# Altium project DMRobot.PrjPcb
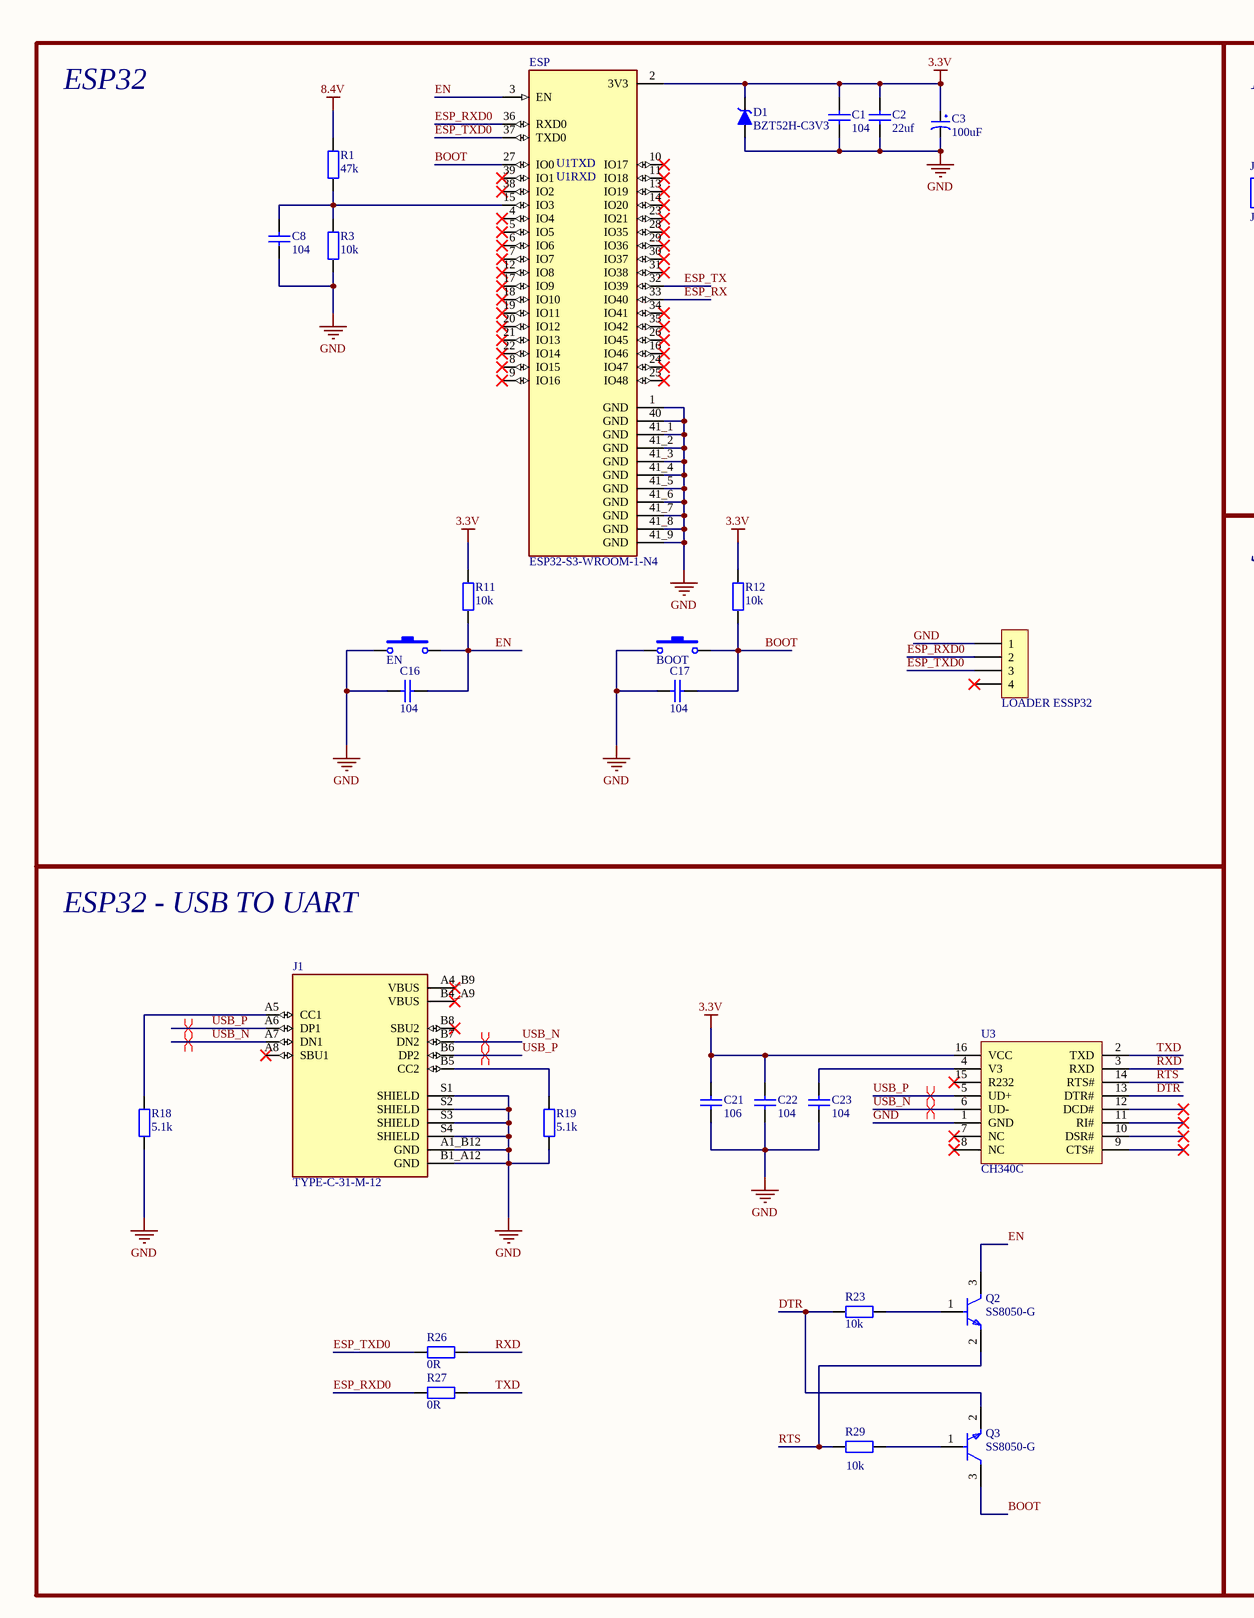
[diagram p0: DMRobotSchematic.SchDoc, left]
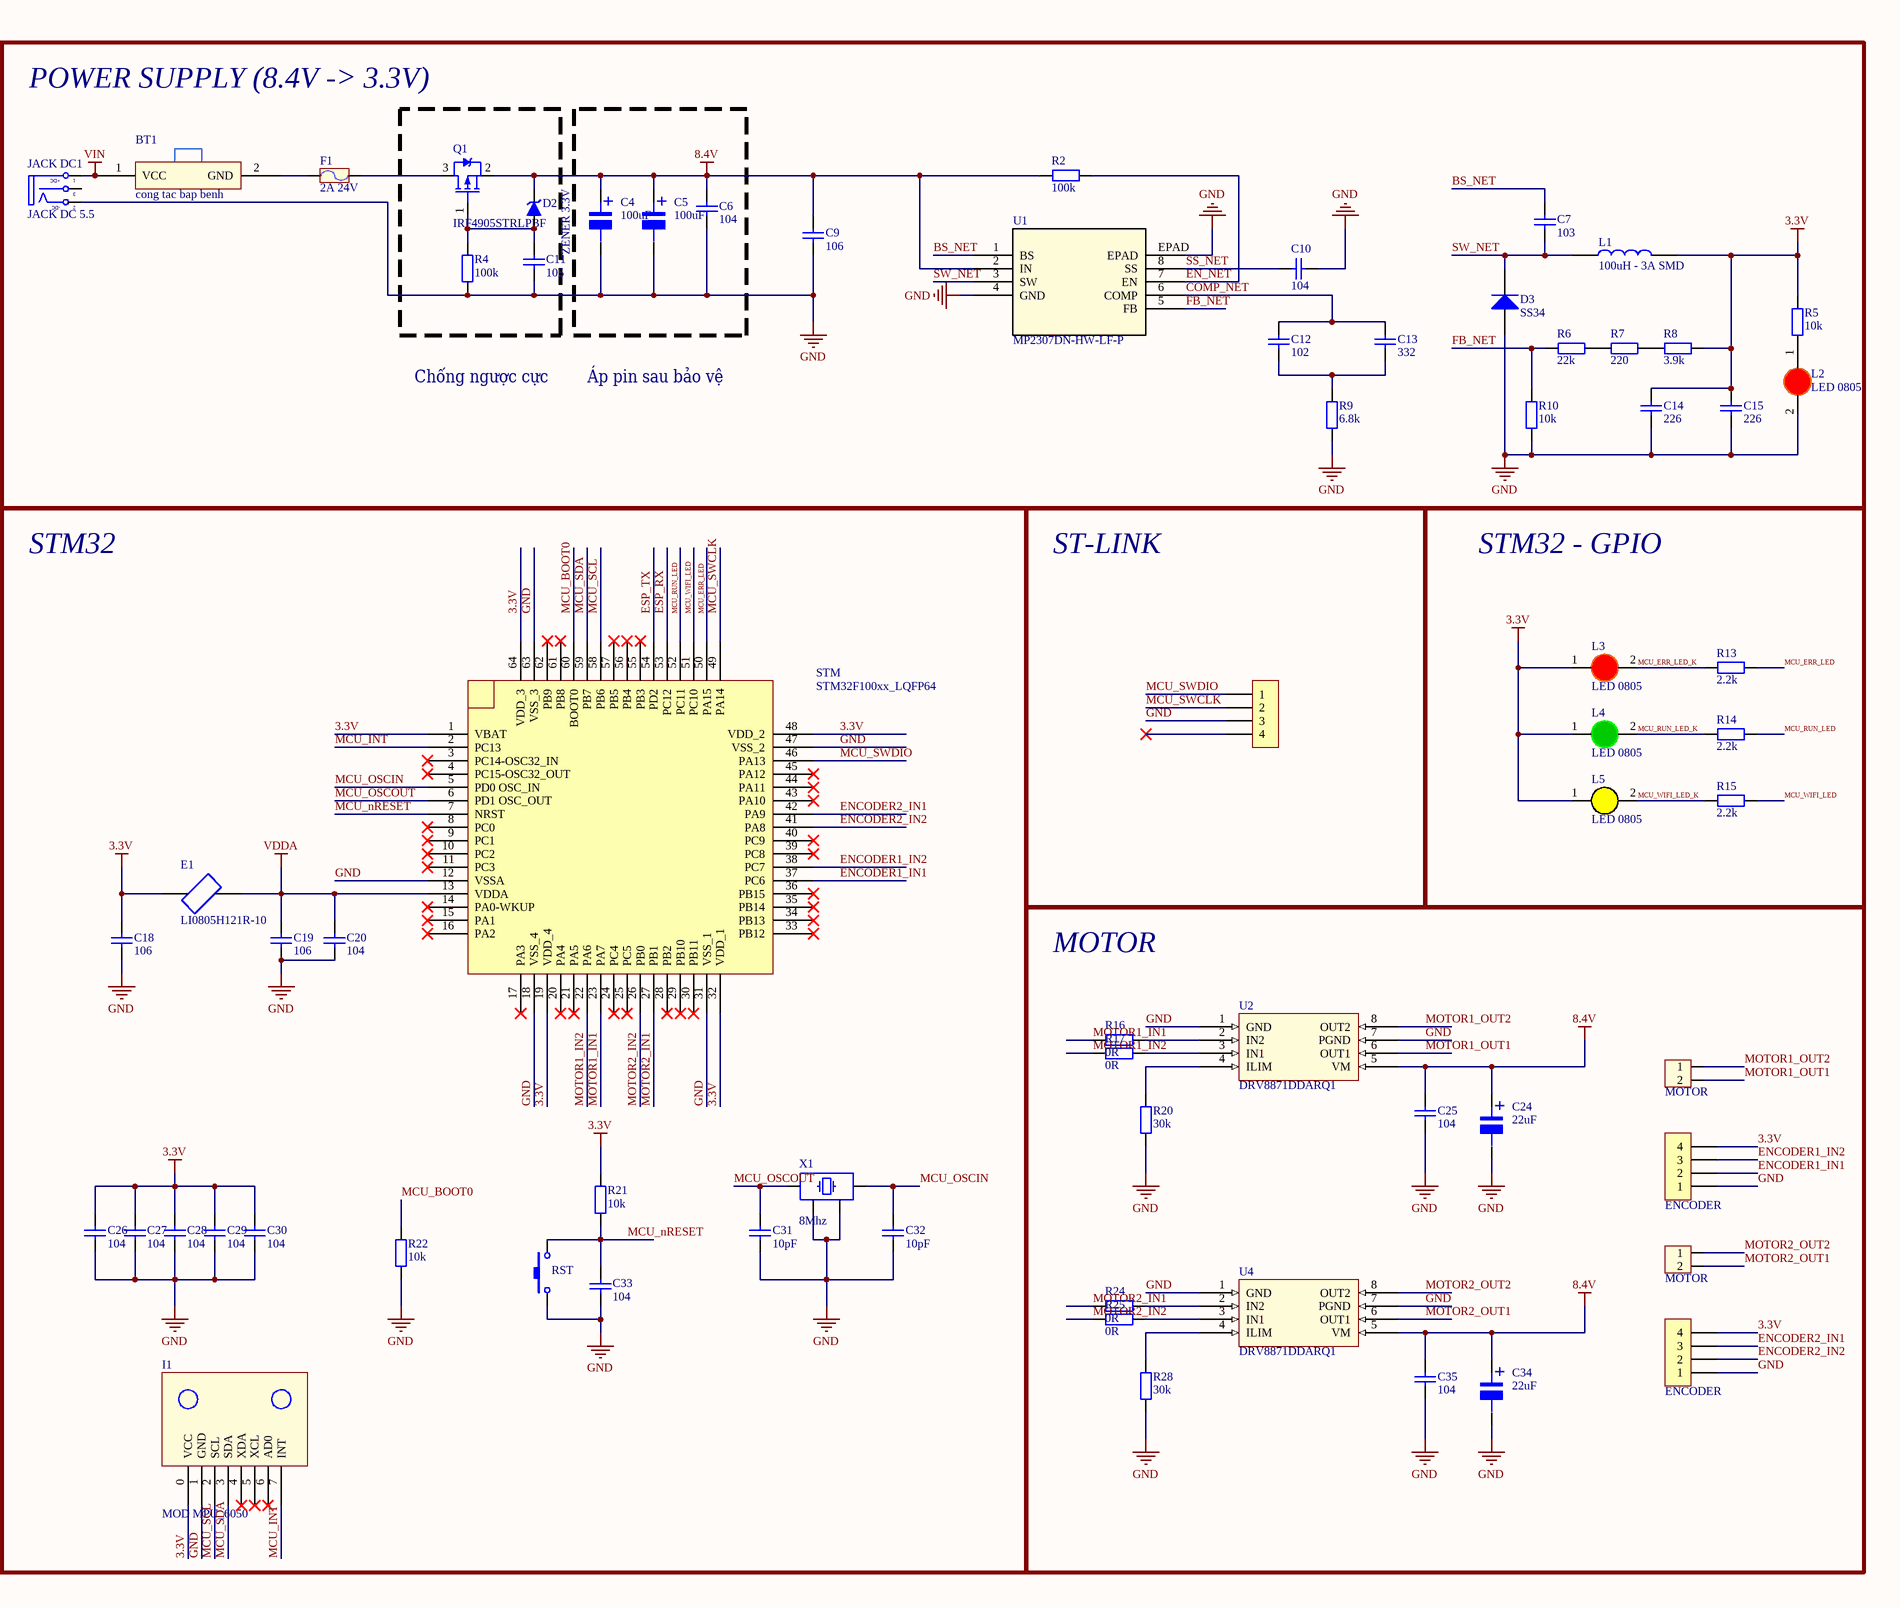
[diagram p1: DMRobotSchematic.SchDoc, right]
1 sheet, 97 parts. Net scope: global (net labels, ports and power ports of the same name join across sheets).
Board file: DMRobotPCB.PcbDoc

## Sheet DMRobotSchematic.SchDoc
size 622 x 355 mm; SheetNumber: 1; SheetTotal: 1

### Parts
BOOT  Nut Nhan 2 Chan SMD 3x6x2.5  [Nut Nhan 2 Chan SMD 3x6x2.5]  (value not drawn)
BT1  cong tac bap benh  [CONG TAC BAP BENH]
C1  104  [tu 0805]
C2  22uf  [tu 0805]
C3  100uF  [tu tantalum smd7343]
C4  100uF  [tu nhom 6.3 (d)]
C5  100uF  [tu nhom 6.3 (d)]
C6  104  [tu 0805]
C7  103  [tu 0805]
C8  104  [tu 0805]
C9  106  [tu 0805]
C10  104  [tu 0805]
C11  105  [tu 0805]
C12  102  [tu 0805]
C13  332  [tu 0805]
C14  226  [tu 1206]
C15  226  [tu 1206]
C16  104  [tu 0805]
C17  104  [tu 0805]
C18  106  [tu 0805]
C19  106  [tu 0805]
C20  104  [tu 0805]
C21  106  [tu 0805]
C22  104  [tu 0805]
C23  104  [tu 0805]
C24  22uF  [tu nhom 6.3 (D)]
C25  104  [tu 0805]
C26  104  [tu 0805]
C27  104  [tu 0805]
C28  104  [tu 0805]
C29  104  [tu 0805]
C30  104  [tu 0805]
C31  10pF  [tu 0805]
C32  10pF  [tu 0805]
C33  104  [tu 0805]
C34  22uF  [tu nhom 6.3 (D)]
C35  104  [tu 0805]
D1  BZT52H-C3V3  [SOD123]
D2  ZENER 3.3V  [SOD123]
D3  SS34  [DIODE SMA]
E1  LI0805H121R-10  [FB_LI0805H121R-10]
EN  Nut Nhan 2 Chan SMD 3x6x2.5  [Nut Nhan 2 Chan SMD 3x6x2.5]  (value not drawn)
ENC1  ENCODER  [XH2.54M-4]
ENC2  ENCODER  [XH2.54M-4]
ESP  ESP32-S3-WROOM-1-N4  [XCVR_ESP32-S3-WROOM-1-N4]
ESP_FLASH  LOADER ESSP32  [XH2.54M-4]
F1  2A 24V  [Cau chi tu phuc hoi 2A 24V SMD1812]
I1  MOD MPU_6050  [MOD MPU-6050]
J1  TYPE-C-31-M-12  [HRO_TYPE-C-31-M-12]
JACK_DC1  JACK DC 5.5  [JACK DC 5.5]
L1  100uH - 3A SMD  [Cuon Cam 12x12x10]
L2  LED 0805  [LED-0805-Red]
L3  LED 0805  [LED-0805-Red]
L4  LED 0805  [LED-0805-Green]
L5  LED 0805  [LED-0805-Yellow]
M1  MOTOR  [XH2.54M-2]
M2  MOTOR  [XH2.54M-2]
Q1  IRF4905STRLPBF  [TO-263 (D2PAK)]
Q2  SS8050-G  [FP-SS8050-G-MFG]
Q3  SS8050-G  [FP-SS8050-G-MFG]
R1  47k  [tro smd 0603]
R2  100k  [tro smd 0805]
R3  10k  [tro smd 0805]
R4  100k  [tro smd 0805]
R5  10k  [tro smd 0805]
R6  22k  [tro smd 0805]
R7  220  [tro smd 0805]
R8  3.9k  [Tro SMD 0805]
R9  6.8k  [tro smd 0805]
R10  10k  [tro smd 0805]
R11  10k  [tro smd 0805]
R12  10k  [tro smd 0805]
R13  2.2k  [tro smd 0805]
R14  2.2k  [tro smd 0805]
R15  2.2k  [tro smd 0805]
R16  0R  [tro smd 0805]
R17  0R  [tro smd 0805]
R18  5.1k  [tro smd 0805]
R19  5.1k  [tro smd 0805]
R20  30k  [tro smd 0805]
R21  10k  [tro smd 0805]
R22  10k  [tro smd 0805]
R23  10k  [tro smd 0805]
R24  0R  [tro smd 0805]
R25  0R  [tro smd 0805]
R26  0R  [tro smd 0805]
R27  0R  [tro smd 0805]
R28  30k  [tro smd 0805]
R29  10k  [tro smd 0805]
RST  Nut Nhan 2 Chan SMD 3x6x2.5  [Nut Nhan 2 Chan SMD 3x6x2.5]  (value not drawn)
STM  STM32F100xx_LQFP64  [STM32_LQFP64]
STM_FLASH  Header 4P 2.54 Duc Thang  [XH2.54M-4]  (value not drawn)
U1  MP2307DN-HW-LF-P  [IC8_MP2307_MNP]
U2  DRV8871DDARQ1  [SOIC8_50_328_25X90_SMT]
U3  CH340C  [SOIC16_50_284_25X90_SMT]
U4  DRV8871DDARQ1  [SOIC8_50_328_25X90_SMT]
X1  8Mhz  [XTAL_3225]

### Blocks framed on the sheet
ESP32: BOOT C1-C3 C8 C16 C17 D1 EN ESP ESP_FLASH R1 R3 R11 R12
POWER SUPPLY (8.4V -> 3.3V): BT1 C4-C7 C9-C15 D2 D3 F1 JACK_DC1 L1 L2 Q1 R2 R4-R10 U1
STM32: C18-C20 C26-C33 E1 I1 R21 R22 RST STM X1
ST-LINK: STM_FLASH
STM32 - GPIO: L3-L5 R13-R15
ESP32 - USB TO UART: C21-C23 J1 Q2 Q3 R18 R19 R23 R26 R27 R29 U3
MOTOR: C24 C25 C34 C35 ENC1 ENC2 M1 M2 R16 R17 R20 R24 R25 R28 U2 U4

### Nets
3.3V: C1.1 C2.2 C3.1 C14.1 C15.1 C18.1 C21.1 C22.2 C26.2 C27.2 C28.2 C29.2 C30.2 D1.2(K) E1.1 ENC1.4 ENC2.4 ESP.2(3V3) I1.0(VCC) L1.2 L3.1(A) L4.1(A) L5.1(A) R5.1 R8.2 R11.2 R12.2 R21.1 STM.1(VBAT) STM.19(VDD_4) STM.32(VDD_1) STM.48(VDD_2) STM.64(VDD_3) U3.16(VCC)
8.4V: C4.1 C5.1 C6.2 C9.1 C24.1 C25.2 C34.1 C35.2 D2.2(K) Q1.2(S) R1.2 R2.1 U1.2(IN) U2.5(VM) U4.5(VM)
GND: BOOT.1 C1.2 C2.1 C3.2 C4.2 C5.2 C6.1 C8.1 C9.2 C10.1 C11.2 C14.2 C15.2 C16.1 C17.1 C18.2 C19.2 C20.1 C21.2 C22.1 C23.1 C24.2 C25.1 C26.1 C27.1 C28.1 C29.1 C30.1 C31.2 C32.2 C33.1 C34.2 C35.1 D1.1(A) D3.1(A) EN.1 ENC1.1 ENC2.1 ESP.1(GND) ESP.40(GND) ESP.41_1(GND) ESP.41_2(GND) ESP.41_3(GND) ESP.41_4(GND) ESP.41_5(GND) ESP.41_6(GND) ESP.41_7(GND) ESP.41_8(GND) ESP.41_9(GND) ESP_FLASH.1 I1.1(GND) J1.A1_B12(GND) J1.B1_A12(GND) J1.S1(SHIELD) J1.S2(SHIELD) J1.S3(SHIELD) J1.S4(SHIELD) JACK_DC1.2(TN) L2.2(K) R3.1 R4.1 R9.2 R10.2 R18.1 R19.1 R20.1 R22.2 R28.1 RST.1 STM.12(VSSA) STM.18(VSS_4) STM.31(VSS_1) STM.47(VSS_2) STM.63(VSS_3) STM_FLASH.3 U1.4(GND) U1.EPAD U2.1(GND) U2.7(PGND) U3.1(GND) U4.1(GND) U4.7(PGND) X1.2 X1.4
VDDA: C19.1 C20.2 E1.2 STM.13(VDDA)
VIN: BT1.1(VCC) JACK_DC1.1(T)
BOOT: BOOT.2 C17.2 ESP.27(IO0) Q3.3(C) R12.1
BS_NET: C7.1 U1.1(BS)
COMP_NET: C12.1 C13.1 U1.6(COMP)
DTR: Q3.2(E) R23.1 U3.13(DTR#)
EN: C16.2 EN.2 ESP.3(EN) Q2.3(C) R11.1
EN_NET: R2.2 U1.7(EN)
ENCODER1_IN1: ENC1.2 STM.37(PC6)
ENCODER1_IN2: ENC1.3 STM.38(PC7)
ENCODER2_IN1: ENC2.3 STM.42(PA9)
ENCODER2_IN2: ENC2.2 STM.41(PA8)
ESP_RX: ESP.33(IO40) STM.53(PC12)
ESP_RXD0: ESP.36(RXD0) ESP_FLASH.2 R27.1
ESP_TX: ESP.32(IO39) STM.54(PD2)
ESP_TXD0: ESP.37(TXD0) ESP_FLASH.3 R26.1
FB_NET: R6.1 R10.1 U1.5(FB)
MCU_BOOT0: R22.1 STM.60(BOOT0)
MCU_ERR_LED: R13.2 STM.50(PA15)
MCU_ERR_LED_K: L3.2(K) R13.1
MCU_INT: I1.7(INT) STM.2(PC13)
MCU_nRESET: C33.2 R21.2 RST.2 STM.7(NRST)
MCU_OSCIN: C32.1 STM.5(PD0_OSC_IN) X1.3
MCU_OSCOUT: C31.1 STM.6(PD1_OSC_OUT) X1.1
MCU_RUN_LED: R14.2 STM.52(PC11)
MCU_RUN_LED_K: L4.2(K) R14.1
MCU_SCL: I1.2(SCL) STM.58(PB6)
MCU_SDA: I1.3(SDA) STM.59(PB7)
MCU_SWCLK: STM.49(PA14) STM_FLASH.2
MCU_SWDIO: STM.46(PA13) STM_FLASH.1
MCU_WIFI_LED: R15.2 STM.51(PC10)
MCU_WIFI_LED_K: L5.2(K) R15.1
MOTOR1_IN1: R16.1 STM.23(PA7)
MOTOR1_IN2: R17.1 STM.22(PA6)
MOTOR1_OUT1: M1.2 U2.6(OUT1)
MOTOR1_OUT2: M1.1 U2.8(OUT2)
MOTOR2_IN1: R24.1 STM.27(PB1)
MOTOR2_IN2: R25.1 STM.26(PB0)
MOTOR2_OUT1: M2.2 U4.6(OUT1)
MOTOR2_OUT2: M2.1 U4.8(OUT2)
RTS: Q2.2(E) R29.1 U3.14(RTS#)
RXD: R26.2 U3.3(RXD)
SS_NET: C10.2 U1.8(SS)
SW_NET: C7.2 D3.2(K) L1.1 U1.3(SW)
TXD: R27.2 U3.2(TXD)
USB_N: J1.A7(DN1) J1.B7(DN2) U3.6(UD-)
USB_P: J1.A6(DP1) J1.B6(DP2) U3.5(UD+)
NetBT1_2: BT1.2(GND) F1.1
NetC8_2: C8.2 ESP.15(IO3) R1.1 R3.2
NetC11_1: C11.1 D2.1(A) Q1.1(G) R4.2
NetC12_2: C12.2 C13.2 R9.1
NetC23_2: C23.2 U3.4(V3)
NetF1_2: F1.2 Q1.3(D)
NetJ1_A5: J1.A5(CC1) R18.2
NetJ1_B5: J1.B5(CC2) R19.2
NetL2_1: L2.1(A) R5.2
NetQ2_1: Q2.1(B) R23.2
NetQ3_1: Q3.1(B) R29.2
NetR6_2: R6.2 R7.1
NetR7_2: R7.2 R8.1
NetR16_2: R16.2 U2.2(IN2)
NetR17_2: R17.2 U2.3(IN1)
NetR20_2: R20.2 U2.4(ILIM)
NetR24_2: R24.2 U4.2(IN2)
NetR25_2: R25.2 U4.3(IN1)
NetR28_2: R28.2 U4.4(ILIM)

Not connected (* = marked no-connect by the designer): ESP 4(IO4)* 5(IO5)* 6(IO6)* 7(IO7)* 8(IO15)* 9(IO16)* 10(IO17)* 11(IO18)* 12(IO8)* 13(IO19)* 14(IO20)* 16(IO46)* 17(IO9)* 18(IO10)* 19(IO11)* 20(IO12)* 21(IO13)* 22(IO14)* 23(IO21)* 24(IO47)* 25(IO48)* 26(IO45)* 28(IO35)* 29(IO36)* 30(IO37)* 31(IO38)* 34(IO41)* 35(IO42)* 38(IO2)* 39(IO1)*; ESP_FLASH 4*; I1 4(XDA)* 5(XCL)* 6(AD0)*; J1 A4_B9(VBUS)* A8(SBU1)* B4_A9(VBUS)* B8(SBU2)*; JACK_DC1 3(S); STM 3(PC14-OSC32_IN)* 4(PC15-OSC32_OUT)* 8(PC0)* 9(PC1)* 10(PC2)* 11(PC3)* 14(PA0-WKUP)* 15(PA1)* 16(PA2)* 17(PA3)* 20(PA4)* 21(PA5)* 24(PC4)* 25(PC5)* 28(PB2)* 29(PB10)* 30(PB11)* 33(PB12)* 34(PB13)* 35(PB14)* 36(PB15)* 39(PC8)* 40(PC9)* 43(PA10)* 44(PA11)* 45(PA12)* 55(PB3)* 56(PB4)* 57(PB5)* 61(PB8)* 62(PB9)*; STM_FLASH 4*; U3 7(NC)* 8(NC)* 9(CTS#)* 10(DSR#)* 11(RI#)* 12(DCD#)* 15(R232)*

### Layout directives
differential pair; differential pair class USB: USB_N, USB_P

### Notes on the sheet
- (near ESP) U1TXD
- (near ESP) U1RXD
- Chống ngược cực
- Áp pin sau bảo vệ
- (in symbol JACK DC 5.5) +DC; -DC
- (in symbol Tu Nhom 22uF 25V) +
- (in symbol Tu Nhom 100uF 25V) +

### Library data of the parts
BOOT EN RST = Nut Nhan 2 Chan SMD 3x6x2.5: Ma_Hang: MH001036; Ten: Nút Nhấn 2 Chân 3x6x2.5MM SMD
C1 C6-C8 C10 C16 C17 C20 C22 C23 C25-C30 C33 C35 = Tu 0805 104 50V 10%: Dán; Don_Vi: Con; So_Chan: 2; Ten_Linh_Kien: Tụ 0805 104-100nF 10% 50V; Ma_Hang: MH004551; Chung_Loai: Dán; Kieu_Chan: *
C2 = Tu 0805 222 50V 10%: Dán; Don_Vi: Con; So_Chan: 2; Ten_Linh_Kien: Tụ 0805 222-2.2nF 10% 50V; Ma_Hang: MH004557; Chung_Loai: Dán; Kieu_Chan: *
C3 = Tu tantalum 100uF 50V SMD7343: Dán; Don_Vi: Con; So_Chan: 2; Ten_Linh_Kien: Tụ tantalum 107T-100uF 50V SMD7343; Ma_Hang: MH008401; Chung_Loai: Dán; Kieu_Chan: *
C4 C5 = Tu Nhom 100uF 25V: Dán; Don_Vi: Con; So_Chan: 2; Ten_Linh_Kien: Tụ Nhôm 100uF 25V 6x7MM; Ma_Hang: MH002222; Chung_Loai: Dán; Kieu_Chan: *
C9 C18 C19 C21 = Tu 0805 106 16V 10%: Dán; Ten_Linh_Kien: Tụ 0805 106-10uF 10% 16V; So_Chan: 2; Don_Vi: Con; Ma_Hang: MH004553; Chung_Loai: Dán; Kieu_Chan: *
C11 = Tu 0805 105 50V 10%: Dán; Don_Vi: Con; So_Chan: 2; Ten_Linh_Kien: Tụ 0805 105-1uF 10% 50V; Ma_Hang: MH004552; Chung_Loai: Dán; Kieu_Chan: *
C12 = Tu 0805 102 50V 10%: Dán; Don_Vi: Con; So_Chan: 2; Ten_Linh_Kien: Tụ 0805 102-1nF 10% 50V; Ma_Hang: MH004549; Chung_Loai: Dán; Kieu_Chan: *
C13 = Tu 0805 332 50V 10%: Dán; Don_Vi: Con; So_Chan: 2; Ten_Linh_Kien: Tụ 0805 332-3.3nF 10% 50V; Ma_Hang: MH004561; Chung_Loai: Dán; Kieu_Chan: *
C14 C15 = Tu 1206 226 16V 20%: Dán; Don_Vi: Con; So_Chan: 2; Ten_Linh_Kien: Tụ 1206 226-22uF 20% 16V; Ma_Hang: MH004546; Chung_Loai: Dán; Kieu_Chan: *
C24 C34 = Tu Nhom 22uF 25V: Dán; Don_Vi: Con; So_Chan: 2; Ten_Linh_Kien: Tụ Nhôm 22uF 25V; Ma_Hang: MH007613; Chung_Loai: Dán; Kieu_Chan: *
C31 C32 = Tu 0805 10pF 50V 10%: Dán; Don_Vi: Con; So_Chan: 2; Ten_Linh_Kien: Tụ 0805 10P 10% 50V; Ma_Hang: MH004554; Chung_Loai: Dán; Kieu_Chan: *
D1 D2 = Diode Zener: Zener Diode
D3 = Diode SS34 ( 1N5822 ): Dán; Don_Vi: Con; Ma_Hang: MH002104; Ten_Linh_Kien: Diode SS34 3A 40V SMA ( 1N5822 SS34A); Kieu_Chan: *; Chung_Loai: Dán
E1 = LI0805H121R-10: EMI Ferrite Chip Bead, 0805, 800MA, 120Ohms @100MHz, DCR Max 0.150Ohm | Laird Performance Materials LI0805H121R-10; SnapEDA_Link: https://www.snapeda.com/parts/LI0805H121R-10/Laird/view-part/?ref=snap; Package: 0805 Laird; Value: *; MF: Laird; MP: LI0805H121R-10; Check_prices: https://www.snapeda.com/parts/LI0805H121R-10/Laird/view-part/?ref=eda
ENC1 ENC2 ESP_FLASH STM_FLASH = Header 4P 2.54 Duc Thang: Cắm; Ten_Linh_Kien: Header 4P XH2.54-4P Đực Thẳng; Don_Vi: Con; Ma_Hang: MH001285; Chung_Loai: Cắm
ESP = ESP32-S3-WROOM-1-N4: MF: {'manufacturer': u'Espressif Systems'}; Package: None; Price: None; Value: *; MP: ESP32-S3-WROOM-1-N4; Availability: Unavailable
F1 = Cau chi tu phuc hoi 2A 24V SMD1812: 2A 24V SMD1812; Ma_Hang: MH010033; Ten: Cầu Chì Tự Phục Hồi 2A 24V SMD1812
J1 = TYPE-C-31-M-12: USB Connectors 24 Receptacle 1 8.94*7.3mm RoHS; MF: HRO Electronics Co., Ltd.; SnapEDA_Link: https://www.snapeda.com/parts/TYPE-C-31-M-12/HRO+Electronics+Co.%252C+Ltd./view-part/?ref=snap; Package: Package; Value: *; MP: TYPE-C-31-M-12; Check_prices: https://www.snapeda.com/parts/TYPE-C-31-M-12/HRO+Electronics+Co.%252C+Ltd./view-part/?ref=eda
JACK_DC1 = JACK DC 5.5: Value: Jac DC
L1 = CUON CAM 100uH SMD: Dán; Ma_Hang: MH003999; Don_Vi: Con; Ten_Linh_Kien: Cuộn Cảm 100uH 7x7x4MM CD74; Kieu_Chan: *; Chung_Loai: Dán
L2 L3 = LED 0805 Do: Dán; Don_Vi: Con; Ma_Hang: MH000897; Ten_Linh_Kien: LED 0805 Màu Đỏ (Red); Ghi_Chu: *; Kieu_Chan: *; Chung_Loai: Dán
L4 = LED 0805 Xanh La: Dán; Don_Vi: Con; Ma_Hang: MH002326; Ten_Linh_Kien: LED 0805 Màu Xanh Lá (Green); Ghi_Chu: *; Kieu_Chan: *; Chung_Loai: Dán
L5 = LED 0805 Vang: Dán; Don_Vi: Con; Ma_Hang: MH002329; Ten_Linh_Kien: LED 0805 Màu Vàng ( Yellow); Ghi_Chu: *; Kieu_Chan: *; Chung_Loai: Dán
M1 M2 = Header 2P 2.54 Duc Thang: Cắm; Ten_Linh_Kien: Header 2P XH2.54-2P Đực Thẳng; Don_Vi: Con; Ma_Hang: MH001283; Chung_Loai: Cắm
Q1 = Mosfet P: pin to pad: 2>3 3>2
Q2 Q3 = CMP-20235-000001-1: NPN TRANSISTOR 1.5A 40V SOT-23 R; Transition Frequency: 100MHz; Max Breakdown Voltage: 25V; Collector Emitter Voltage (VCEO): 400mV; Max Power Dissipation: 300mW; Max Collector Current: 1.5A; Case/Package: TO-236-3; Packaging: Tape and Reel; RoHS Compliant: Yes; Mount: Surface Mount; Collector Emitter Breakdown Voltage: 25V
R1 = Tro 0603 5% 47k: Dán; Chung_loai: Dám; Don_Vi: Con; So_Chan: 2; Ten_Linh_Kien: Trở 0603 5% 47k; Ma_Hang: MH007665; Kieu_Chan: *
R2 R4 = Tro 0805 5% 100k: Dán; Don_Vi: Con; So_Chan: 2; Ten_Linh_Kien: Trở 0805 5% 100k; Ma_Hang: MH005250; Chung_Loai: Dán; Kieu_Chan: *
R3 R5 R10-R12 R21-R23 R29 = Tro 0805 5% 10k: Dán; Don_Vi: Con; So_Chan: 2; Ten_Linh_Kien: Trở 0805 5% 10k; Ma_Hang: MH005239; Chung_Loai: Dán; Kieu_Chan: *
R6 = Tro 0805 5% 22k: Dán; Don_Vi: Con; So_Chan: 2; Ten_Linh_Kien: Trở 0805 5% 22k; Ma_Hang: MH005248; Chung_Loai: Dán; Kieu_Chan: *
R7 = Tro 0805 5% 220R: Dán; Don_Vi: Con; So_Chan: 2; Ten_Linh_Kien: Trở 0805 5% 220R; Ma_Hang: MH005259; Chung_Loai: Dán; Kieu_Chan: *
R8 = Tro 0805 5% 3.9k: Dán; Don_Vi: Con; Ma_Hang: MH007670; Ten_Linh_Kien: Trở 0805 5% 3.9k; So_Chan: 2; Chung_Loai: Dán; Kieu_Chan: *
R9 = Tro 0805 5% 6.8k: Dán; Don_Vi: Con; So_Chan: 2; Ten_Linh_Kien: Trở 0805 5% 6.8k; Ma_Hang: MH005311; Chung_Loai: Dán; Kieu_Chan: *
R13-R15 = Tro 0805 5% 2.2k: Dán; Don_Vi: Con; So_Chan: 2; Ten_Linh_Kien: Trở 0805 5% 2.2k; Ma_Hang: MH005237; Chung_Loai: Dán; Kieu_Chan: *
R16 R17 R24-R27 = Tro 0805 5% 0R: Dán; Don_Vi: Con; So_Chan: 2; Ten_Linh_Kien: Trở 0805 5% 0R; Ma_Hang: MH005230; Chung_Loai: Dán; Kieu_Chan: *
R18 R19 = Tro 0805 1% 5.1k: Dán; Don_Vi: Con; So_Chan: 2; Ten_Linh_Kien: Trở 0805 1% 5.1k; Ma_Hang: MH008812; Chung_Loai: Dán; Kieu_Chan: *
R20 R28 = Tro 0805 5% 30k: Dán; Don_Vi: Con; So_Chan: 2; Ten_Linh_Kien: Trở 0805 5% 30k; Ma_Hang: MH005314; Chung_Loai: Dán; Kieu_Chan: *
U1 = MP2307DN-HW-LF-P: 3A 23V 340KHz Synchronous Rectified Step-Down Converter; Manufacturer_Name: Monolithic Power Systems; Copyright: Copyright (C) 2025 Ultra Librarian. All rights reserved.; Manufacturer_Part_Number: MP2307DN-HW-LF-P; Datasheet: https://www.monolithicpower.com/en/documentview/productdocument/index/version/2/document_type/Datasheet/lang/en/sku/MP2307; RefDes: RefDes; Type: Type
U2 U4 = IC_DRV8871DDARQ1: Unipolar Motor Driver NMOS PWM 8-SO PowerPad; Manufacturer: Texas Instruments; Alternate Part Number-1: NA; Manufacturer Part Number: DRV8871DDARQ1; Case/Package: SOIC-8; Supplier-1: ARROW; Supplier Part Number-1: DRV8871DDARQ1
U3 = IC_CH340C: USB Bridge, USB to UART USB 2.0 UART Interface; Manufacturer: Olimex; Alternate Part Number-1: NA; Manufacturer Part Number: CH340C; Case/Package: SOIC16; Supplier-1: LCSC; Supplier Part Number-1: C84681
X1 = TSX-3225_24.0000MF15X-AC: Crystal SMD 24MHz 10PPM 7pF 3225; Manufacturer: Epson; Manufacturer Part Number: TSX-3225 24.0000MF15X-AC